# Altium schematic sheet [02] - MCU.SchDoc: =ProjectName
size A4; CheckedBy: Ven; Author: Ven; CompanyName: HUST; Revision: V.1.0
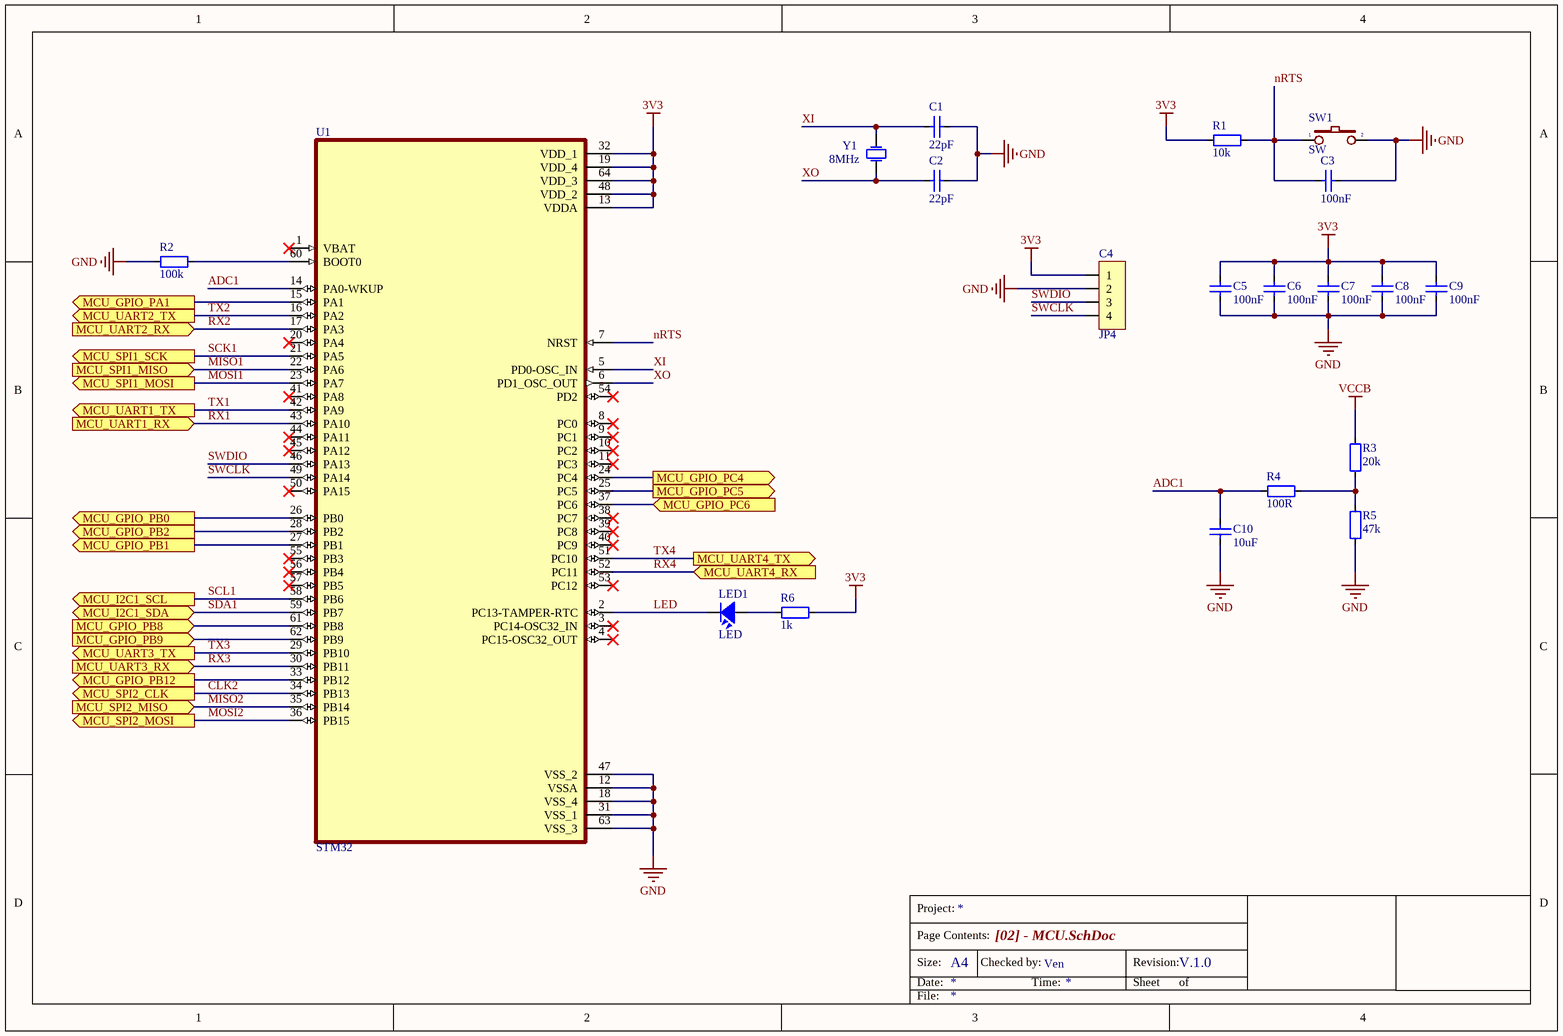
[diagram p0: [02] - MCU.SchDoc]

## Parts
C1  22pF  [CAP_0603]
C2  22pF  [CAP_0603]
C3  100nF  [CAP_0603]
C4  JP4  [JP4-C1T]
C5  100nF  [CAP_0603]
C6  100nF  [CAP_0603]
C7  100nF  [CAP_0603]
C8  100nF  [CAP_0603]
C9  100nF  [CAP_0603]
C10  10uF  [CAP_0603]
LED1  LED  [LED-0805-Red]
R1  10k  [RES-SMD-0603]
R2  100k  [RES-SMD-0603]
R3  20k  [RES-SMD-0603]
R4  100R  [RES-SMD-0603]
R5  47k  [RES-SMD-0603]
R6  1k  [RES-SMD-0603]
SW1  SW  [SW2]
U1  STM32  [QFP50P1200X1200X160-64N]
Y1  8MHz  [XTAL 5032 SMD]

## Ports
MCU_GPIO_PA1 (out), MCU_GPIO_PB0 (out), MCU_GPIO_PB1 (out), MCU_GPIO_PB2 (out), MCU_GPIO_PB8 (in), MCU_GPIO_PB9 (in), MCU_GPIO_PB12 (out), MCU_GPIO_PC4 (out), MCU_GPIO_PC5 (out), MCU_GPIO_PC6 (in), MCU_I2C1_SCL (out), MCU_I2C1_SDA (bidir), MCU_SPI1_MISO (in), MCU_SPI1_MOSI (out), MCU_SPI1_SCK (out), MCU_SPI2_CLK (out), MCU_SPI2_MISO (in), MCU_SPI2_MOSI (out), MCU_UART1_RX (in), MCU_UART1_TX (out), MCU_UART2_RX (in), MCU_UART2_TX (out), MCU_UART3_RX (in), MCU_UART3_TX (out), MCU_UART4_RX (in), MCU_UART4_TX (out)

## Nets
3V3: C4.1 C5.2 C6.2 C7.2 C8.2 C9.2 R1.1 R6.1 U1.13(VDDA) U1.19(VDD_4) U1.32(VDD_1) U1.48(VDD_2) U1.64(VDD_3)
GND: C1.1 C2.1 C3.1 C4.2 C5.1 C6.1 C7.1 C8.1 C9.1 C10.2 R2.1 R5.2 SW1.2 U1.12(VSSA) U1.18(VSS_4) U1.31(VSS_1) U1.47(VSS_2) U1.63(VSS_3)
VCCB: R3.1
ADC1: C10.1 R4.1 U1.14(PA0-WKUP)
CLK2: U1.34(PB13) ; port MCU_SPI2_CLK
LED: LED1.2 U1.2(PC13-TAMPER-RTC)
MCU_GPIO_PA1: U1.15(PA1) ; port MCU_GPIO_PA1
MCU_GPIO_PB0: U1.26(PB0) ; port MCU_GPIO_PB0
MCU_GPIO_PB1: U1.27(PB1) ; port MCU_GPIO_PB1
MCU_GPIO_PB2: U1.28(PB2) ; port MCU_GPIO_PB2
MCU_GPIO_PB8: U1.61(PB8) ; port MCU_GPIO_PB8
MCU_GPIO_PB9: U1.62(PB9) ; port MCU_GPIO_PB9
MCU_GPIO_PB12: U1.33(PB12) ; port MCU_GPIO_PB12
MCU_GPIO_PC4: U1.24(PC4) ; port MCU_GPIO_PC4
MCU_GPIO_PC5: U1.25(PC5) ; port MCU_GPIO_PC5
MCU_GPIO_PC6: U1.37(PC6) ; port MCU_GPIO_PC6
MISO1: U1.22(PA6) ; port MCU_SPI1_MISO
MISO2: U1.35(PB14) ; port MCU_SPI2_MISO
MOSI1: U1.23(PA7) ; port MCU_SPI1_MOSI
MOSI2: U1.36(PB15) ; port MCU_SPI2_MOSI
nRTS: C3.2 R1.2 SW1.1 U1.7(NRST)
RX1: U1.43(PA10) ; port MCU_UART1_RX
RX2: U1.17(PA3) ; port MCU_UART2_RX
RX3: U1.30(PB11) ; port MCU_UART3_RX
RX4: U1.52(PC11) ; port MCU_UART4_RX
SCK1: U1.21(PA5) ; port MCU_SPI1_SCK
SCL1: U1.58(PB6) ; port MCU_I2C1_SCL
SDA1: U1.59(PB7) ; port MCU_I2C1_SDA
SWCLK: C4.4 U1.49(PA14)
SWDIO: C4.3 U1.46(PA13)
TX1: U1.42(PA9) ; port MCU_UART1_TX
TX2: U1.16(PA2) ; port MCU_UART2_TX
TX3: U1.29(PB10) ; port MCU_UART3_TX
TX4: U1.51(PC10) ; port MCU_UART4_TX
XI: C1.2 U1.5(PD0-OSC_IN) Y1.2(OSC2)
XO: C2.2 U1.6(PD1_OSC_OUT) Y1.1(OSC1)
NetLED1_1: LED1.1 R6.2
NetR2_2: R2.2 U1.60(BOOT0)
NetR3_2: R3.2 R4.2 R5.1

Not connected (* = marked no-connect by the designer): U1 1(VBAT)* 3(PC14-OSC32_IN)* 4(PC15-OSC32_OUT)* 8(PC0)* 9(PC1)* 10(PC2)* 11(PC3)* 20(PA4)* 38(PC7)* 39(PC8)* 40(PC9)* 41(PA8)* 44(PA11)* 45(PA12)* 50(PA15)* 53(PC12)* 54(PD2)* 55(PB3)* 56(PB4)* 57(PB5)*

## Notes on the sheet
- Project:
- Page Contents:
- Size:
- Date:
- A4
- Checked by:
- Time:
- Revision:
- Sheet
- of
- File:

## Library data of the parts
C1-C3 C5-C10 = CapSMD: Capacitor; Value: 33p; Published: 8-Jun-2000; LatestRevisionDate: 17-Jul-2002; LatestRevisionNote: Re-released for DXP Platform.; PackageReference: RAD-0.3; Publisher: Altium Limited
C4 = JP4: WR-PHD 2.54 mm Angled Socket Header; Manufacturer: W¨¹rth Elektronik eiSos GmbH; partNo: 613004143121; ComponentLink1 Description: Manufacturer; ComponentLink2 Description: Datasheet; NoPins: 04; Created Date: 29 March 2013; ComponentLink1URL: http://www.we-online.com; ComponentLink2URL: http://katalog.we-online.de/em/datasheet/6130xx143121.pdf; Created by: Karrer Zheng
LED1 = LED: LED Single colour Green and Red; Value: LED 3 ly Single Colour
R1-R6 = Resistor - SMD: Resistor; Manufacturer: Generic Components; Class: Passive; Published: 08/06/2000; Publisher: Altium Hobart Technology Centre
SW1 = SW2: Switch button 2 pin; Value: SW chip 2 pin
U1 = STM32F103RCT6: STM32 ARM-based 32-bit MCU 72MHz 256KB
Y1 = XTAL: Crystal Oscillator; Published: 8-Jun-2000; LatestRevisionDate: 17-Jul-2002; LatestRevisionNote: Re-released for DXP Platform.; PackageReference: R38; Publisher: Altium Limited